# EAGLE design Nav (EAGLE 9.6.2)
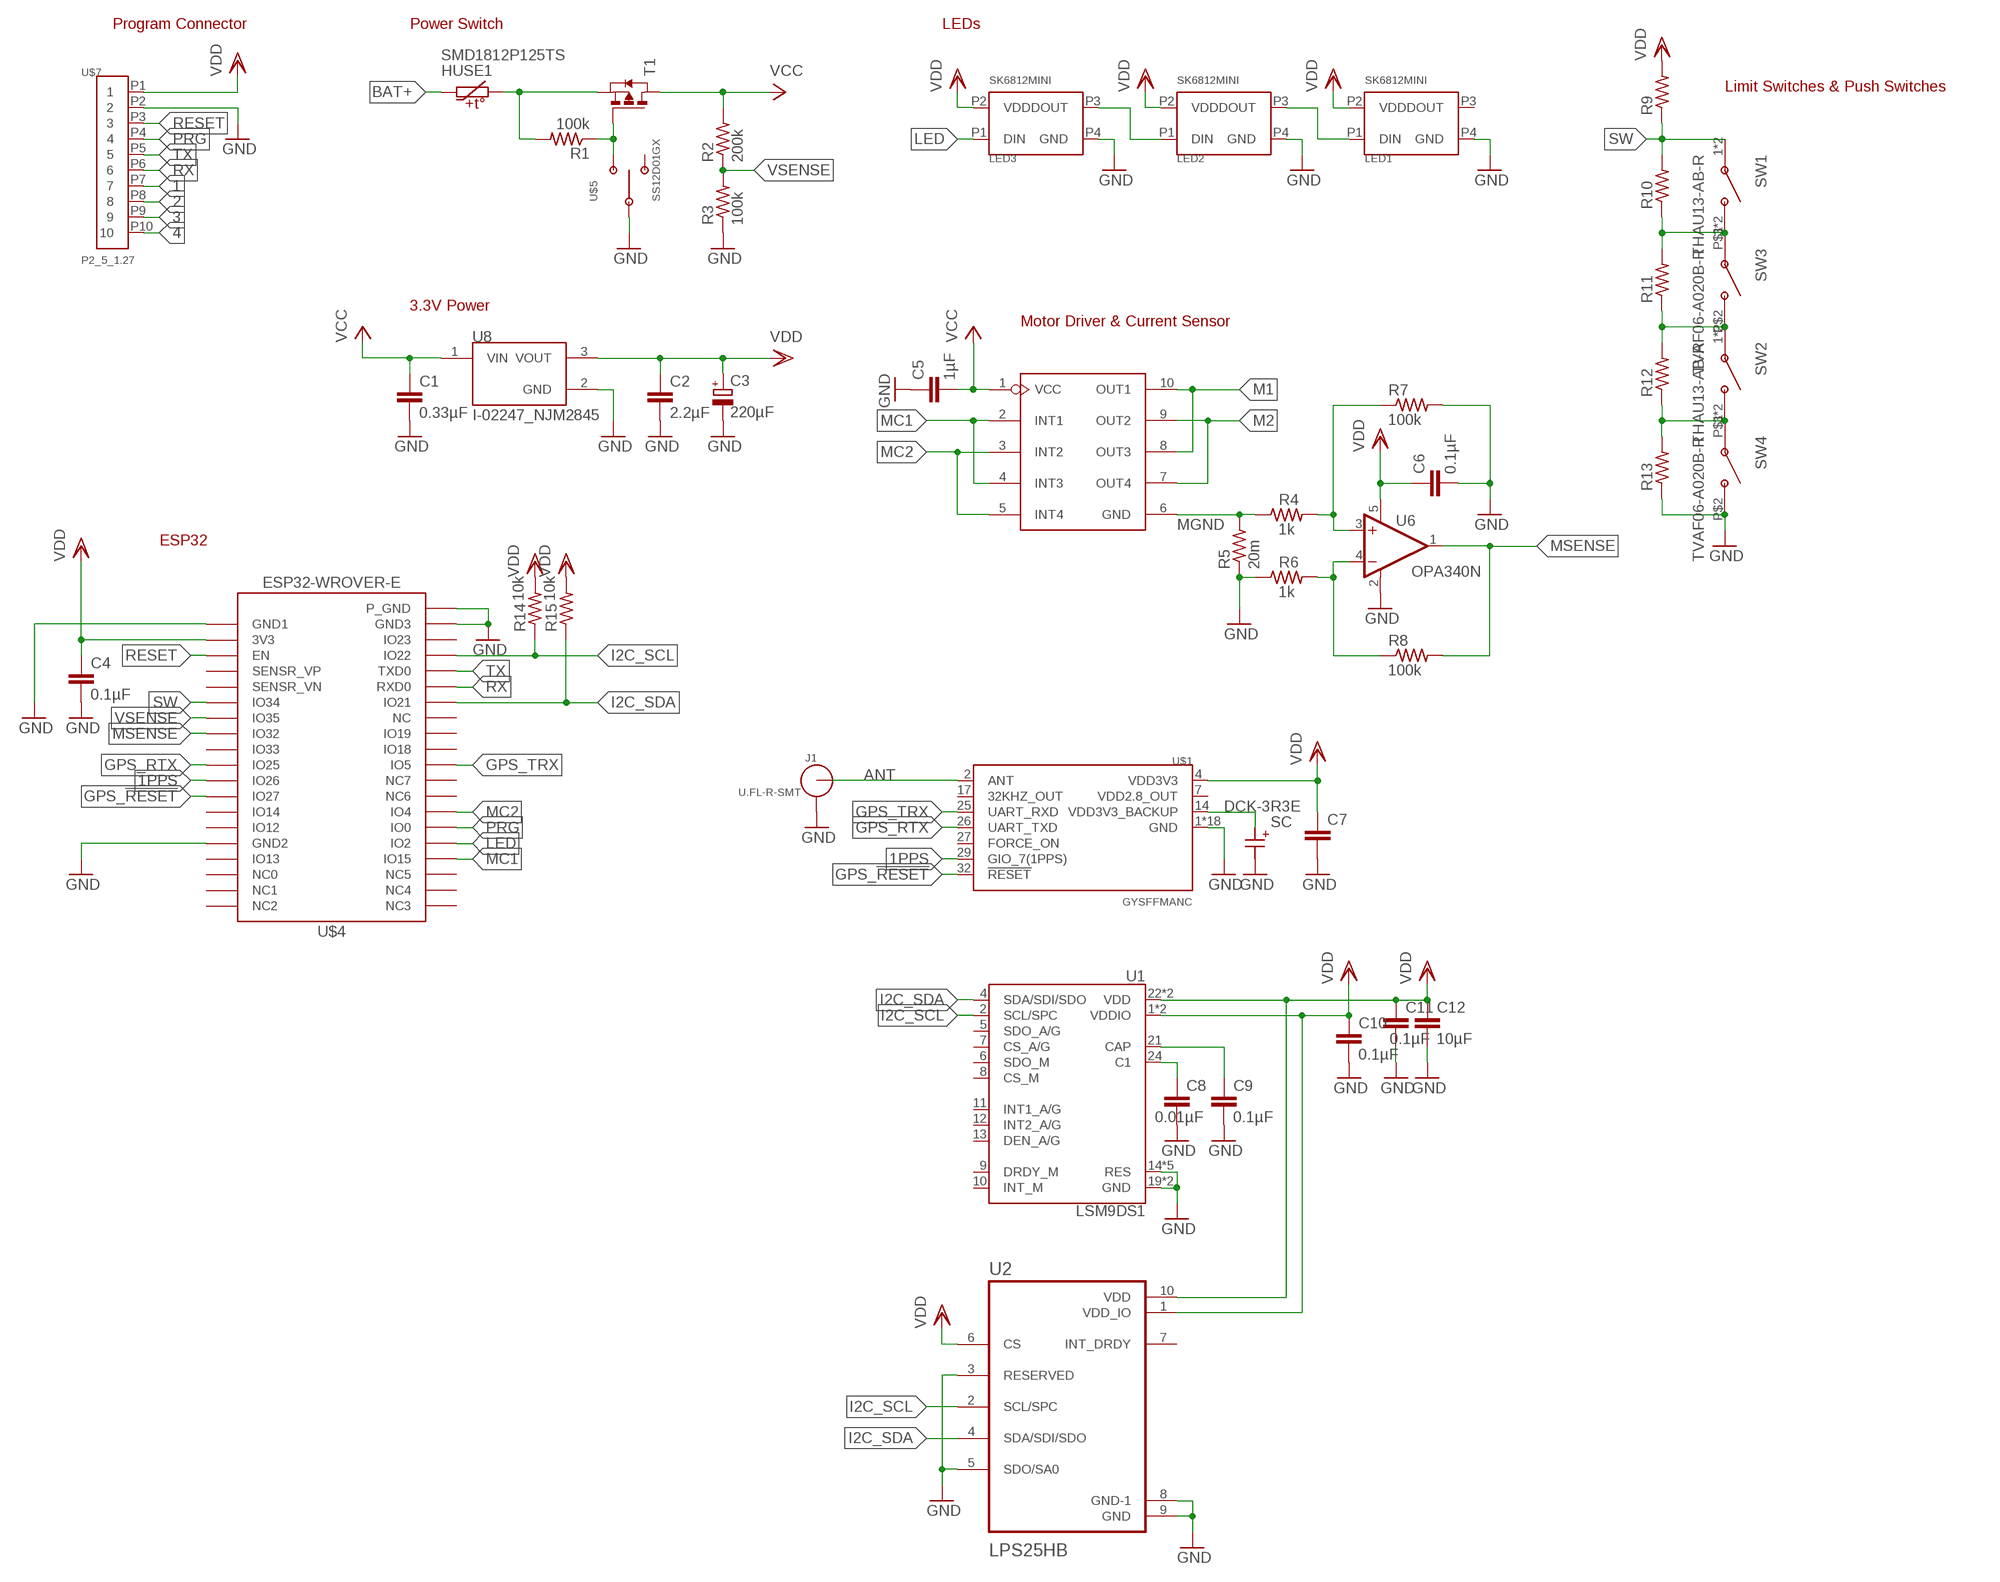
[diagram p0: schematic, sheet 1]

## Parts
C1  0.33µF  C-EUC0603  [C0603]
C2  2.2µF  C-EUC0603  [C0603]
C3  220µF  CPOL-EUUD-6,3X7,7  [UD-6,3X7,7_NICHICON]
C4  0.1µF  C-EUC0603  [C0603]
C5  1µF  C-EUC0603  [C0603]
C6  0.1µF  C-EUC0603  [C0603]
C7  C-EUC0603  [C0603]
C8  0.01µF  C-EUC0603  [C0603]
C9  0.1µF  C-EUC0603  [C0603]
C10  0.1µF  C-EUC0603  [C0603]
C11  0.1µF  C-EUC0603  [C0603]
C12  10µF  C-EUC0603  [C0603]
HUSE1  SMD1812P125TS  [SMD1812P]
J1  U.FL-R-SMT  [U.FL_SMT]
LED1  SK6812MINI  [SK68XXMINI]
LED2  SK6812MINI  [SK68XXMINI]
LED3  SK6812MINI  [SK68XXMINI]
R1  100k  R-US_R0603  [R0603]
R2  200k  R-US_R0603  [R0603]
R3  100k  R-US_R0603  [R0603]
R4  1k  R-US_R0603  [R0603]
R5  20m  R-US_R6332W  [R6332W]
R6  1k  R-US_R0603  [R0603]
R7  100k  R-US_R0603  [R0603]
R8  100k  R-US_R0603  [R0603]
R9  R-US_R0603  [R0603]
R10  R-US_R0603  [R0603]
R11  R-US_R0603  [R0603]
R12  R-US_R0603  [R0603]
R13  R-US_R0603  [R0603]
R14  10k  R-US_R0603  [R0603]
R15  10k  R-US_R0603  [R0603]
SC  DCK-3R3E  [DC,DCK]
SW1  THAU13-AB-R  [THAU13-AB-R]
SW2  THAU13-AB-R  [THAU13-AB-R]
SW3  TVAF06-A020B-R  [TVAF06-A020B-R]
SW4  TVAF06-A020B-R  [TVAF06-A020B-R]
T1  PMOSSOT23  [SOT-23]
U1  LSM9DS1  [LGA24-8X4]
U2  LPS25HB  [PQFN60P250X250X80-10N]
U6  OPA340N  [SOT23-5]
U7  DRIVER-LV8548MC-AH(SOIC10)  [SOIC10-1.0-5X4MM]
U8  I-02247_NJM2845  [TO252]
U$1  GYSFFMANC  [GYSFFMANC]
U$4  ESP32-WROVER-E  [ESP32-WROVER-E]
U$5  SS12D01GX  [SS12D01GX]
U$7  P2_5_1.27  [P2_5_1.27]

## Nets
1: U$7.P7
1PPS: U$1.29(GIO_7(1PPS)) U$4.IO26
2: U$7.P8
3: U$7.P9
4: U$7.P10
ANT: J1.SIG(ANT) U$1.2(ANT)
BAT+: HUSE1.1
GND: C1.2 C2.2 C3.- C4.2 C5.1 C6.2 C7.2 C8.2 C9.2 C10.2 C11.2 C12.2 J1.GND1 J1.GND2 LED1.P4(GND) LED2.P4(GND) LED3.P4(GND) R3.1 R5.1 R6.1 R7.2 R13.1 SC.- SW4.P$2(B) U1.14(RES) U1.15(RES) U1.16(RES) U1.17(RES) U1.18(RES) U1.19(GND) U1.20(GND) U2.3(RESERVED) U2.5(SDO/SA0) U2.8(GND-1) U2.9(GND) U6.2(V-) U8.2(GND) U$1.1(GND) U$1.3(GND) U$1.8(GND) U$1.10(GND) U$1.12(GND) U$1.22(GND) U$1.33(GND) U$1.36(GND) U$1.37(GND) U$1.38(GND) U$1.39(GND) U$1.40(GND) U$1.41(GND) U$1.42(GND) U$1.43(GND) U$1.44(GND) U$1.45(GND) U$1.46(GND) U$4.GND1 U$4.GND2 U$4.GND3 U$4.P_GND U$5.2(C) U$7.P2
GPS_!RESET!: U$1.32(!RESET!) U$4.IO27
GPS_RTX: U$1.26(UART_TXD) U$4.IO25
GPS_TRX: U$1.25(UART_RXD) U$4.IO5
I2C_SCL: R14.1 U1.2(SCL/SPC) U2.2(SCL/SPC) U$4.IO22
I2C_SDA: R15.1 U1.4(SDA/SDI/SDO) U2.4(SDA/SDI/SDO) U$4.IO21
LED: LED3.P1(DIN) U$4.IO2
M1: U7.8(OUT3) U7.10(OUT1)
M2: U7.7(OUT4) U7.9(OUT2)
MC1: U7.2(INT1) U7.4(INT3) U$4.IO15
MC2: U7.3(INT2) U7.5(INT4) U$4.IO4
MGND: R4.1 R5.2 U7.6(GND)
MSENSE: R8.2 U6.1(OUT) U$4.IO32
N$1: SC.+ U$1.14(VDD3V3_BACKUP)
N$4: C8.1 U1.24(C1)
N$6: C9.1 U1.21(CAP)
N$13: HUSE1.2 R1.2 T1.2(S)
N$14: R6.2 R8.1 U6.4(-IN)
N$15: R4.2 R7.1 U6.3(+IN)
N$16: R1.1 T1.3(G) U$5.1(A)
N$17: LED2.P1(DIN) LED3.P3(DOUT)
N$18: LED1.P1(DIN) LED2.P3(DOUT)
N$19: R11.1 R12.2 SW2.1(A) SW2.2(A) SW3.P$2(B)
N$20: R10.1 R11.2 SW1.3(B) SW1.4(B) SW3.P$1(A)
N$21: R12.1 R13.2 SW2.3(B) SW2.4(B) SW4.P$1(A)
PRG: U$4.IO0 U$7.P4
RESET: U$4.EN U$7.P3
RX: U$4.RXD0 U$7.P6
SW: R9.1 R10.2 SW1.1(A) SW1.2(A) U$4.IO34
TX: U$4.TXD0 U$7.P5
VCC: C1.1 C5.2 R2.2 T1.1(D) U7.1(VCC) U8.1(VIN)
VDD: C2.1 C3.+ C4.1 C6.1 C7.1 C10.1 C11.1 C12.1 LED1.P2(VDD) LED2.P2(VDD) LED3.P2(VDD) R9.2 R14.2 R15.2 U1.1(VDDIO) U1.3(VDDIO) U1.22(VDD) U1.23(VDD) U2.1(VDD_IO) U2.6(CS) U2.10(VDD) U6.5(V+) U8.3(VOUT) U$1.4(VDD3V3) U$4.3V3 U$7.P1
VSENSE: R2.1 R3.2 U$4.IO35
Unconnected: LED1.P3(DOUT) U1.5(SDO_A/G) U1.6(SDO_M) U1.7(CS_A/G) U1.8(CS_M) U1.9(DRDY_M) U1.10(INT_M) U1.11(INT1_A/G) U1.12(INT2_A/G) U1.13(DEN_A/G) U2.7(INT_DRDY) U$1.17(32KHZ_OUT) U$1.27(FORCE_ON) U$4.IO12 U$4.IO13 U$4.IO14 U$4.IO16(NC6) U$4.IO17(NC7) U$4.IO18 U$4.IO19 U$4.IO23 U$4.IO33 U$4.NC U$4.NC0 U$4.NC1 U$4.NC2 U$4.NC3 U$4.NC4 U$4.NC5 U$4.SENSOR_VN(SENSR_VN) U$4.SENSOR_VP(SENSR_VP) U$5.3(B)

## Notes on the sheet
- Program Connector | Power Switch | LEDs
- Limit Switches & Push Switches
- 3.3V Power
- Motor Driver & Current Sensor
- ESP32

## Power pins joined to a net without a drawn wire
VDD2.8_OUT: U$1.7(VDD2.8_OUT)

## Library data of the parts
C1 C2 C4-C12 = rcl:C-EU: CAPACITOR, European symbol; SPICEPREFIX: C
C3 = rcl:CPOL-EU: POLARIZED CAPACITOR, European symbol; SPICEPREFIX: C
HUSE1 = ptc:SMD1812P125TS
J1 = connector:U.FL-R-SMT: U.FL-R-SMT Antenna Connector; DIGIKEY: H122041-ND; MANUFACTURER: Hirose; MPN: U.FL-R-SMT-1(01)
LED1-LED3 = leds:SK6812MINI
R1-R15 = rcl:R-US_: RESISTOR, American symbol; SPICEPREFIX: R
SC = capacitors:DCK-3R3E
SW1 SW2 = switches:THAU13-AB-R
SW3 SW4 = switches:TVAF06-A020B-R
T1 = zetex:PMOSSOT23: MOS FET; OC_FARNELL: unknown; OC_NEWARK: unknown
U1 = LSM9DS1:LSM9DS1: LSM9DS1 3D accelerometer, gyroscope & magnetometer The LSM9DS1 is a system-in-package featuring a 3D digital linear acceleration sensor, a 3D digital angular rate sensor, and a 3D digital magnetic sensor. The LSM9DS1 has a linear acceleration full scale of ±2g/±4g/±8/±16 g, a magnetic field full scale of ±4/±8/±12/±16 gauss and an angular rate of ±245/±500/±2000 dps. The LSM9DS1 includes an I2 C serial bus interface supporting standard and fast mode (100 kHz and 400 kHz) and an SPI serial standard interface. Magnetic, accelerometer and gyroscope sensing can be enabled or set in power-down mode separately for smart power management. The LSM9DS1 is available in a plastic land grid array package (LGA) and it is guaranteed to operate over an extended temperature range from -40 °C to +85 °C.; PROD_ID: IC-12536
U2 = LPS25HB:LPS25HB: None Check availability <https://pricing.snapeda.com/parts/LPS25HB/STMicroelectronics/view-part?ref=eda>; AVAILABILITY: In Stock; DESCRIPTION: Pressure Sensor 3.77PSI ~ 18.27PSI (26kPa ~ 126kPa) Absolute - 24 b 10-VFLGA; MF: STMicroelectronics; MP: LPS25HB; PACKAGE: VFLGA-10 STMicroelectronics; PRICE: None; PURCHASE-URL: https://pricing.snapeda.com/search/part/LPS25HB/?ref=eda
U6 = burr-brown:OPA340: Rail-to-Rail Operational Amplifiers Single-Supply, MicroAmplifier(TM) Series; MPN: OPA340NA/3KG4; OC_FARNELL: 1234805; OC_NEWARK: 13M5177
U7 = DRIVER-LV8548MC-AH_SOIC10_:DRIVER-LV8548MC-AH(SOIC10): 310030259 Check prices <https://pricing.snapeda.com/parts/LV8548MC-AH/ON%20Semiconductor/view-part?ref=eda>; AVAILABILITY: Not in stock; DESCRIPTION: Half Bridge (4) Driver DC Motors, General Purpose, Stepper Motors DMOS 10-SOIC; MF: ON Semiconductor; MP: LV8548MC-AH; PACKAGE: SOIC NB-10 ON Semiconductor; PRICE: None
U8 = akizuki:I-02247_NJM2845
U$1 = gps:GYSFFMANC
U$4 = esp32:ESP32-WROVER-E
U$5 = switches:SS12D01GX
U$7 = pins:P2_5_1.27

## Board
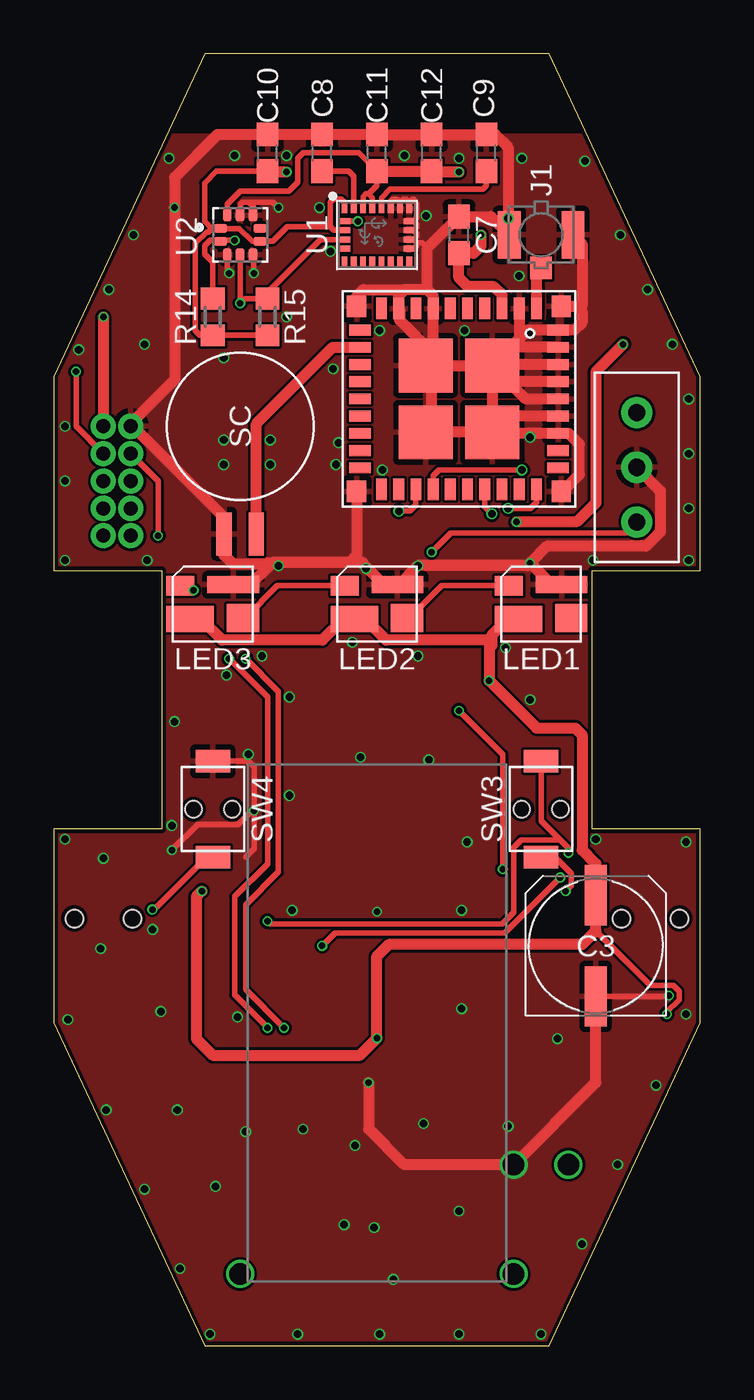
[diagram p1: board, top side]
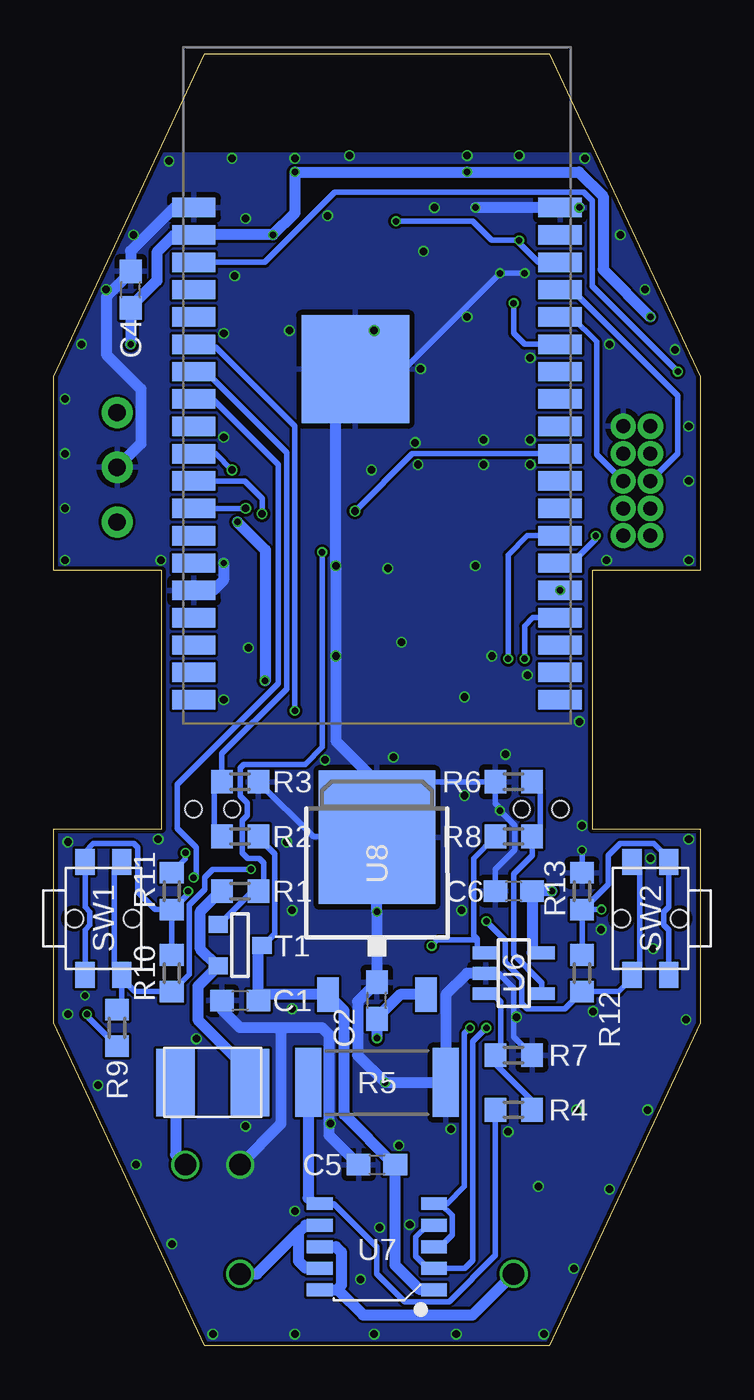
[diagram p2: board, bottom side, seen from below]

Size 30 x 60 mm. Coordinates in mm from the lower left corner, seen from the top.
Outline: 7,0 23,0 30,15 30,24 25,24 25,36 30,36 30,45 23,60 7,60 0,45 0,36 5,36 5,24 0,24 0,15 7,0
Copper layers (1*16): Top 0.035mm / dielectric 1mm / Bottom 0.035mm
Design rules "jlcpcb-2layers-1.0mm": minimum track width 5mil, minimum drill 0.3mm, track to track 5mil, track to pad 5mil, pad to pad 5mil, via to via 5mil, smd to smd 5mil, copper to edge 0.2mm, drill to drill 6mil, minimum pad ring 10mil, minimum via ring 3mil, stop-mask expansion 4mil, vias tented up to drill 0mil, thermal gap 10mil
tKeepout: area -35,27.5 to 65,32.5

### Footprints (pad centres in the part's own frame; a part is rotated, then mirrored left to right if it is on the bottom)
C0603 = smd 1.1 x 1: 1 -0.85,0; 2 0.85,0
UD-6,3X7,7_NICHICON = smd 2.8 x 1: + 2.35,0; - -2.35,0
SMD1812P = smd 1.78 x 3.15: 1 -1.725,0; 2 1.725,0
U.FL_SMT = smd 1.05 x 2.2: GND1 -1.475,0; GND2 1.475,0 | smd 1 x 1.05: SIG 0,-1.525
SK68XXMINI = smd 1.3 x 0.9: P1 1.5,-0.85 | smd 2.2 x 1.2: P2 1.05,0.7 | smd 1.5 x 1.3: P3 -1.4,0.65 | smd 2.4 x 0.8: P4 -0.95,-0.9
R0603 = smd 1 x 1.1: 1 -0.85,0; 2 0.85,0
R6332W = smd 1.2 x 3.2: 1 -3.196,0; 2 3.196,0
DC,DCK = smd 0.7 x 2: + 0.75,-5; - -0.75,-5
THAU13-AB-R = smd 1.2 x 0.9: 1 -2.625,0.85; 2 2.625,0.85; 3 -2.625,-0.85; 4 2.625,-0.85 | hole 0.8: 0,1.35; 0,-1.35
TVAF06-A020B-R = smd 1.6 x 1.05: P$1 0,2.225; P$2 0,-2.225 | hole 0.75: -0.9,0; 0.9,0
SOT-23 = smd 0.787 x 0.889: 1 0.025,-1.016; 2 -0.94,1.016; 3 0.991,1.016
LGA24-8X4 = smd 0.27 x 0.45: 1 -1.505,1.225; 6 -1.505,-1.225; 7 -1.075,-1.225; 8 -0.645,-1.225; 9 -0.215,-1.225; 10 0.215,-1.225; 11 0.645,-1.225; 12 1.075,-1.225; 13 1.505,-1.225; 18 1.505,1.225; 19 1.075,1.225; 20 0.645,1.225; 21 0.215,1.225; 22 -0.215,1.225; 23 -0.645,1.225; 24 -1.075,1.225 | smd 0.45 x 0.27: 2 -1.475,0.645; 3 -1.475,0.215; 4 -1.475,-0.215; 5 -1.475,-0.645; 14 1.475,-0.645; 15 1.475,-0.215; 16 1.475,0.215; 17 1.475,0.645
PQFN60P250X250X80-10N = smd 0.59 x 0.4: 1 -0.92,0.3; 2 -0.92,-0.3; 6 0.92,-0.3; 7 0.92,0.3 | smd 0.4 x 0.59: 3 -0.6,-0.92; 4 0,-0.92; 5 0.6,-0.92; 8 0.6,0.92; 9 0,0.92; 10 -0.6,0.92
SOT23-5 = smd 0.6 x 1.2: 1 -0.95,-1.306; 2 0,-1.306; 3 0.95,-1.306; 4 0.95,1.306; 5 -0.95,1.306
SOIC10-1.0-5X4MM = smd 0.6 x 1.2: 1 -2,-2.65; 2 -1,-2.65; 3 0,-2.65; 4 1,-2.65; 5 2,-2.65; 6 2,2.65; 7 1,2.65; 8 0,2.65; 9 -1,2.65; 10 -2,2.65
TO252 = smd 1 x 1.6: 1 -2.28,-4.8; 3 2.28,-4.8 | smd 5.4 x 6.2: 2 0,2.5
GYSFFMANC = smd 1 x 0.9: 1 -4.3,4.75; 12 -4.3,-4.75; 22 4.3,-4.75; 33 4.3,4.75 | smd 1 x 0.5: 2 -4.2,3.6; 3 -4.2,2.8; 4 -4.2,2; 5 -4.2,1.2; 6 -4.2,0.4; 7 -4.2,-0.4; 8 -4.2,-1.2; 9 -4.2,-2; 10 -4.2,-2.8; 11 -4.2,-3.6; 23 4.2,-3.6; 24 4.2,-2.8; 25 4.2,-2; 26 4.2,-1.2; 27 4.2,-0.4; 28 4.2,0.4; 29 4.2,1.2; 30 4.2,2; 31 4.2,2.8; 32 4.2,3.6 | smd 0.5 x 1: 13 -3.2,-4.6; 14 -2.4,-4.6; 15 -1.6,-4.6; 16 -0.8,-4.6; 17 0,-4.6; 18 0.8,-4.6; 19 1.6,-4.6; 20 2.4,-4.6; 21 3.2,-4.6; 34 3.2,4.6; 35 2.4,4.6; 36 1.6,4.6; 37 0.8,4.6; 38 0,4.6; 39 -0.8,4.6; 40 -1.6,4.6; 41 -2.4,4.6; 42 -3.2,4.6 | smd 2.5 x 2.5: 43 -1.55,1.55; 44 -1.55,-1.55; 45 1.55,-1.55; 46 1.55,1.55
ESP32-WROVER-E = smd 2 x 0.9: 3V3 -8.5,10.16; EN -8.5,8.89; GND1 -8.5,11.43; GND2 -8.5,-6.35; GND3 8.5,11.43; IO0 8.5,-5.08; IO2 8.5,-6.35; IO4 8.5,-3.81; IO5 8.5,0; IO12 -8.5,-5.08; IO13 -8.5,-7.62; IO14 -8.5,-3.81; IO15 8.5,-7.62; IO16 8.5,-2.54; IO17 8.5,-1.27; IO18 8.5,1.27; IO19 8.5,2.54; IO21 8.5,5.08; IO22 8.5,8.89; IO23 8.5,10.16; IO25 -8.5,0; IO26 -8.5,-1.27; IO27 -8.5,-2.54; IO32 -8.5,2.54; IO33 -8.5,1.27; IO34 -8.5,5.08; IO35 -8.5,3.81; NC 8.5,3.81; NC0 -8.5,-8.89; NC1 -8.5,-10.16; NC2 -8.5,-11.43; NC3 8.5,-11.43; NC4 8.5,-10.16; NC5 8.5,-8.89; RXD0 8.5,6.35; SENSOR_VN -8.5,6.35; SENSOR_VP -8.5,7.62; TXD0 8.5,7.62 | smd 5 x 5: P_GND -1,3.93
SS12D01GX = drill 0.8: 1 -2.54,0; 2 0,0; 3 2.54,0
P2_5_1.27 = drill 0.65 pad 1.016: P1 0,2.54; P2 1.27,2.54; P3 0,1.27; P4 1.27,1.27; P5 0,0; P6 1.27,0; P7 0,-1.27; P8 1.27,-1.27; P9 0,-2.54; P10 1.27,-2.54

### Placement (x,y rotation side)
C1  21.35,16.03 180 bottom
C2  15,16.03 90 bottom
C3  25.16,18.57 90 top
C4  26.43,49.05 90 bottom
C5  15,8.41 0 bottom
C6  8.65,21.11 180 bottom
C7  18.81,51.59 90 top
C8  12.46,55.4 90 top
C9  20.08,55.4 90 top
C10  9.92,55.4 90 top
C11  15,55.4 90 top
C12  17.54,55.4 90 top
HUSE1  22.62,12.22 0 bottom
J1  22.62,51.59 0 top
LED1  22.62,34.45 180 top
LED2  15,34.45 180 top
LED3  7.38,34.45 180 top
R1  21.35,21.11 180 bottom
R2  21.35,23.65 0 bottom
R3  21.35,26.19 180 bottom
R4  8.65,10.95 0 bottom
R5  15,12.22 180 bottom
R6  8.65,26.19 0 bottom
R7  8.65,13.49 0 bottom
R8  8.65,23.65 180 bottom
R9  27.06,14.76 270 bottom
R10  24.52,17.3 270 bottom
R11  24.52,21.11 270 bottom
R12  5.47,17.3 270 bottom
R13  5.47,21.11 270 bottom
R14  7.38,47.78 270 top
R15  9.92,47.78 270 top
SC  8.65,42.7 0 top
SW1  27.7,19.84 270 bottom
SW2  2.3,19.84 90 bottom
SW3  22.62,24.92 180 top
SW4  7.38,24.92 180 top
T1  21.35,18.57 90 bottom
U1  15,51.59 0 top
U2  8.65,51.59 0 top
U6  8.65,17.3 270 bottom
U7  15,4.6 90 bottom
U8  15,21.11 0 bottom
U$1  18.81,43.97 270 top
U$4  15,41.43 0 bottom
U$5  27.06,40.8 90 top
U$7  2.3,40.16 0 top

### Tracks (layer width: path | path; a pad name or v marks a point on that pad's centre or on a via)
1PPS  (via drill 0.35)
  Top 0.254: v20.33,38.64 20.01,38.96 U$1.29
  Bottom 0.254: U$4.IO26 21.14,40.16 20.33,39.35 v20.33,38.64
ANT
  Top 0.508: U$1.2 22.41,49.86 J1.SIG
BAT+  (via drill 1 pad 1.3)
  Bottom 0.508: v23.89,8.41 24.34,8.86 HUSE1.1
GND  (via drill 0.3, 0.35, 1 pad 1.3)
  Top 0.254: U2.9 8.65,52.99 8.78,53.11 9.03,53.11 | 9.03,53.11 9.25,52.89 U2.8 | U1.20 15.64,53.12 15.76,53.24 15.92,53.24 16.07,53.09 | 16.07,53.09 U1.19 | 16.5,53.09 16.35,53.24 16.23,53.24 16.07,53.09 | U1.18 | U1.18 16.5,53.09 | 16.85,51.22 16.85,51.1 16.69,50.94 16.48,50.94 U1.14 | 16.85,51.22 16.7,51.38 U1.15 | U1.15 | 16.76,51.74 16.85,51.65 16.85,51.53 16.7,51.38 U1.15 | U1.17 16.7,52.23 | U1.17 | 16.7,52.23 | 16.5,53.09 16.66,53.24 | 16.7,53.24 16.66,53.24 | 16.66,53.24 16.86,53.04 16.86,52.39 16.76,52.3 16.7,52.23 | 16.85,51.22 17.08,51.22 17.34,50.97 | 9.03,53.11 10.17,53.11 v10.43,52.86 | U2.5 9.29,50.64 v9.29,49.81 | U2.3 8.05,49.9 v8.14,49.81 | U1.16 16.7,51.8 16.85,51.96 16.85,52.08 16.7,52.23 | C3.- 28.51,16.22 v28.55,16.26 | 8.9,22.7 9.29,23.09 v9.29,24.85 | SW4.P$2 9.03,27.14 9.29,26.88 v9.29,24.85 | v5.47,23.02 6.68,24.22 8.57,24.22 9.21,24.85 v9.29,24.85 | U1.17 16.7,52.23
  Top 0.508: 13.73,36.38 10.16,36.38 10.1,36.32 | 10.1,36.32 8.3,36.32 7.9,36.72 SC.- 7.9,38.47 3.67,42.7 U$7.P2 3.57,42.83 5.6,44.86 v5.6,52.86 5.6,54.26 7.59,56.25 C10.2 C8.2 C11.2 C12.2 C9.2 20.5,56.25 21.1,55.65 v21.1,52.35 21.1,51.64 J1.GND1 20.3,52.44 C7.2 17.34,50.97 17.34,49.05 | U$1.44 17.61,45.87 U$1.8 17.61,48.78 17.34,49.05 | 17.34,49.05 16.28,49.05 | 16.28,49.05 16.01,48.78 U$1.10 16.05,48.13 16.05,47.64 17.26,46.43 U$1.44 | 20.41,42.37 U$1.36 23.9,42.37 24.4,41.87 24.4,40.47 23.6,39.67 U$1.33 | U$1.3 21.61,46.77 | 21.61,46.77 21.35,46.51 | 21.35,46.51 20.41,45.57 | 21.61,46.77 22.01,47.17 U$1.42 24.17,47.17 24.52,47.53 24.52,48.03 24.29,48.27 | U$1.41 21.49,46.37 21.35,46.51 | U$1.40 20.41,45.57 | U$1.39 21.11,44.77 U$1.43 | U$1.38 21.91,43.97 U$1.43 | U$1.37 21.21,43.17 20.41,42.37 | 24.29,48.27 24.52,48.27 24.52,51.16 J1.GND2 | U$1.1 24.29,48.27 | U$1.22 14.06,36.71 13.73,36.38 | U$1.12 14.06,48.75 14.37,49.05 16.28,49.05 | U$1.44 17.54,45.52 | 17.54,45.52 U$1.43 | U$1.43 20.41,45.57 | U$1.43 U$1.46 | U$1.46 20.41,42.37 | U$1.46 U$1.45 17.54,42.7 17.54,45.52 | LED2.P4 15.15,35.34 | 10.1,36.32 10.03,36.24 | 10.03,36.24 9.13,35.34 LED3.P4 | LED2.P4 16.03,35.34 v16.91,36.22 21.98,36.22 v22.11,36.35 | LED1.P4 23.12,35.34 v22.11,36.35 | C3.- 25.16,12.22 v21.35,8.41 16.27,8.41 14.62,10.06 v14.62,12.22 | U$5.2 28.17,39.69 28.17,37.8 27.49,37.13 22.89,37.13 v22.11,36.35 | 9.92,36.35 10.03,36.24 | LED2.P4 15.31,35.34 14.37,36.3 14.37,36.35 14.34,36.38 13.73,36.38
  Bottom 0.254: v8.14,49.81 v9.29,49.81 13.74,45.36 U$4.P_GND | U6.2 9.35,17.3 8.65,16.6 8.65,14.34 R7.2 | R6.1 12.42,26.19 14.96,23.65 | 14.96,23.65 U8.2 | R3.1 17.96,23.65 14.96,23.65 | R6.1 9.5,26.24 | 9.45,21.11 C6.2 9.5,22.13 8.61,23.02 8.61,24.17 v9.29,24.85 9.29,24.98 9.5,25.19 R6.1 | v5.47,23.02 R13.1
  Bottom 0.508: U$4.GND1 24.41,52.86 26.43,50.84 C4.2 26.43,49.85 27.56,48.72 27.56,46.03 25.96,44.43 25.96,41.9 U$5.2 | C5.1 17.21,9.77 17.21,14.44 17.54,14.76 19.45,14.76 | 19.45,14.76 21.35,14.76 22.2,15.61 C1.2 | U6.2 10.81,17.3 11.8,16.3 R5.1 v14.62,12.22 15.89,13.49 15.89,15.99 C2.2 v15,20.16 U8.2 15,26.19 16.91,28.09 v16.91,32.03 v16.91,36.22 16.91,45.36 U$4.P_GND | v22.11,36.35 22.11,35.56 22.59,35.08 U$4.GND2 | U$4.P_GND 15.88,45.24 | 15,44.36 U$4.P_GND | v21.35,8.41 19.45,10.32 19.45,14.76 | v5.6,52.86 U$4.GND3 v10.43,52.86
  other vias: 29.48,36.48 29.48,38.89 29.48,41.43 29.48,43.97 28.72,46.51 27.57,49.05 26.3,51.59 24.65,55.02 21.73,55.15 18.81,55.15 16.27,55.27 10.81,55.27 8.4,55.27 5.35,55.15 3.7,51.59 2.55,49.05 1.16,46.26 0.52,42.7 0.52,40.16 0.52,36.48 4.33,36.48 5.6,28.98 5.47,24.16 0.52,23.52 0.65,15.14 2.43,10.95 4.21,7.27 5.86,3.58 7.25,0.54 11.32,0.54 15.13,0.54 18.81,0.54 22.62,0.54 24.52,4.73 26.18,8.41 27.95,12.09 29.35,15.39 29.35,23.4 25.16,23.52 22.11,30 20.97,32.41 25.03,36.48 10.43,36.22 14.49,36.1 13.1,40.92 10.05,40.92 10.05,42.06 13.22,41.94 12.97,45.37 17.29,52.48 12.84,50.83 10.81,47.78 7.89,45.88 7.89,42.06 7.89,40.92 4.21,46.51 22.11,47.02 22.11,42.19 19.06,47.14 15.25,40.67 15.13,47.14 13.86,32.67 9.67,32.03 10.94,30.13 10.94,25.55 11.06,20.22 8.02,31.14 9.03,27.46 8.52,15.27 8.9,9.93 4.59,19.33 2.3,22.63 2.17,18.44 4.97,15.52 5.73,10.95 7.51,7.39 17.16,10.32 14.87,5.49 21.1,10.19 23.38,14.25 18.94,15.65 15.76,3.08 18.81,6.25 13.98,9.3 11.57,10.06 13.48,5.62 18.94,20.22 19.19,23.4 17.41,27.21 14.24,27.33 12.33,52.86 21.6,49.69
  pour Top: -2.78,56.29 32.78,56.29 32.78,-1.75 -2.78,-1.75
  pour Bottom: -4.05,55.4 34.05,55.4 34.05,-1.75 -1.51,-1.75 -4.05,-1.75
GPS_!RESET!  (via drill 0.35)
  Top 0.254: U$1.32 22.41,39.19 22.11,38.89 v21.1,38.89 20.97,38.89
  Bottom 0.254: v21.1,38.89 U$4.IO27
GPS_RTX  (via drill 0.35)
  Top 0.254: U$1.26 17.61,40.41 17.87,40.67 v21.73,40.67
  Bottom 0.254: U$4.IO25 22.49,41.43 v21.73,40.67
GPS_TRX  (via drill 0.35)
  Top 0.254: U$1.25 16.81,39.05 16.52,38.76 v16.02,38.76
  Bottom 0.254: v16.02,38.76 13.35,41.43 U$4.IO5
I2C_SCL  (via drill 0.3)
  Top 0.254: U1.2 v14.1,52.23 v14.11,52.23 | U2.2 7.78,51.34 | 7.78,51.34 v8.4,51.34 | R14.1 7.38,50.32 7,50.7 7,51.08 7.25,51.34 7.78,51.34
  Bottom 0.254: v14.11,52.23 10.55,52.23 9.67,51.34 v8.4,51.34 8.4,51.21 7.51,50.32 U$4.IO22
I2C_SDA  (via drill 0.3)
  Top 0.254: U2.4 8.65,50.32 8.65,50.07 v8.65,48.41 8.87,48.63 R15.1 9.92,48.92 12.37,51.38 U1.4
  Bottom 0.254: v8.65,48.41 8.65,47.02 8.14,46.51 U$4.IO21
LED  (via drill 0.3)
  Top 0.254: v6.49,35.08 6.28,35.3 LED3.P1
  Bottom 0.254: U$4.IO2 v6.49,35.08
M1  (via drill 1 pad 1.3)
  Bottom 0.508: U7.8 16.91,4.6 16.65,4.35 16.65,2.82 16.87,2.6 | U7.10 16.87,2.6 | 16.87,2.6 16.81,2.6 15.63,1.43 10.55,1.43 v8.65,3.33
M2  (via drill 1 pad 1.3)
  Bottom 0.508: U7.9 18.31,3.6 18.63,3.92 18.63,5.28 | 18.63,5.28 18.31,5.6 U7.7 | v21.35,3.33 20.58,3.33 18.63,5.28
MC1  (via drill 0.3)
  Top 0.254: v9.92,14.76 8.4,16.28 8.4,20.86 9.92,22.38 9.92,30.13 v8.14,31.91
  Bottom 0.254: U7.4 12.65,5.6 13.2,5.05 13.2,4.15 12.65,3.6 U7.2 10.92,3.6 10.55,3.96 10.55,14.12 v9.92,14.76 | U$4.IO15 7.76,33.81 8.14,33.43 v8.14,31.91
MC2  (via drill 0.3)
  Top 0.254: v8.9,31.91 10.43,30.38 10.43,22 8.9,20.48 8.9,16.54 v10.68,14.76
  Bottom 0.254: U7.3 12.05,4.6 11.5,5.15 11.5,6.05 12.05,6.6 U7.5 11.73,6.6 10.94,7.39 10.94,14.51 v10.68,14.76 | U$4.IO4 8.02,37.62 8.9,36.73 v8.9,31.91
MGND
  Bottom 0.254: U7.6 17,6.6 15,4.6 15,3.33 13.72,2.05 11.64,2.05 9.5,4.19 R4.1
  Bottom 0.508: R5.2 18.2,6.85 17.95,6.6 U7.6
MSENSE  (via drill 0.3)
  Top 0.254: v12.46,18.57 13.06,19.17 20.93,19.17 v23.51,21.74
  Bottom 0.254: R8.2 10.52,22.63 10.52,19.06 10.34,18.88 10.34,18.84 | 10.34,18.84 10.34,18.25 U6.1 | 10.34,18.84 12.19,18.84 v12.46,18.57 | v23.51,21.74 23.38,21.87 23.38,23.14 24.27,24.03 24.27,26.06 19.57,30.76 19.57,40.92 22.62,43.97 U$4.IO32
N$1
  Top 0.508: SC.+ 9.4,42.81 12.96,46.37 U$1.14
N$4
  Top 0.254: U1.24 13.93,54.32 13.69,54.55 C8.1
N$6
  Top 0.254: C9.1 20.08,53.88 19.92,53.72 15.6,53.72 15.21,53.33 U1.21
N$13
  Bottom 0.508: HUSE1.2 20.89,12.73 23.31,15.14 23.31,16.69 T1.2 22.42,17.63 23.19,18.41 23.19,20.17 22.25,21.11 R1.2
N$14
  Bottom 0.254: R6.2 7.42,25.81 7.42,24.03 R8.1 | R8.1 7.8,23.4 | 7.64,16.35 U6.4 7.34,16.86 8.65,18.16 8.65,21.91 7.8,22.76 R8.1
N$15
  Bottom 0.254: R4.2 7.8,11.38 9.5,13.08 R7.1 9.25,13.74 9.25,15.97 9.63,16.35 U6.3
N$16  (via drill 0.3)
  Top 0.254: U$5.1 26.56,37.75 18.43,37.75 v17.54,36.86
  Bottom 0.254: T1.3 22.32,19.56 20.77,21.11 R1.1 20.25,21.36 20.25,22.42 20.46,22.63 21.01,22.63 21.25,22.88 21.25,24.39 21.02,24.63 21.02,25.21 21.35,25.54 21.35,26.82 21.17,27 18.34,27 17.54,27.8 v17.54,36.86
N$17
  Top 0.254: LED2.P1 10.38,35.3 8.88,33.8 LED3.P3
N$18
  Top 0.254: 16.45,33.74 LED2.P3 16.5,33.8 18,35.3 LED1.P1
N$19  (via drill 0.3)
  Top 0.254: v23.89,22.89 23.89,23.11 23.51,23.49 | 23.51,23.49 22.62,24.38 SW3.P$2 | v9.92,19.71 10.05,19.59 20.81,19.59 21.35,20.12 21.35,23.14 21.7,23.49 23.51,23.49
  Bottom 0.254: R11.1 23.89,22.59 v23.89,22.89 | SW2.2 2.8,22.11 2.8,17.57 SW2.1 3.15,17.06 3.77,16.45 R12.2 6.28,15.65 8.02,15.65 8.27,15.9 8.27,17.05 9.03,17.81 9.03,18.82 v9.92,19.71
N$20  (via drill 0.3)
  Top 0.254: SW3.P$1 23.26,22.7 24.02,21.93 24.02,21.36 v23.76,21.11
  Bottom 0.254: R11.2 24.48,20.26 23.76,20.97 v23.76,21.11 | SW1.4 28.55,19.31 28.32,19.54 28.32,20.14 28.55,20.37 SW1.3 28.55,22.94 28.17,23.32 26.3,23.32 26.11,23.13 26.11,21.08 25.29,20.26 R11.2 | R10.1 R11.2
N$21  (via drill 0.3)
  Top 0.254: v4.57,20.26 4.67,20.26 7.11,22.7 SW4.P$1
  Bottom 0.254: R13.2 5.43,20.26 4.26,21.42 4.26,22.76 3.71,23.32 2.15,23.32 1.45,22.62 SW2.4 1.45,20.37 1.68,20.14 1.68,19.54 1.45,19.31 SW2.3 | R12.1 R13.2 | R13.2 v4.57,20.26
PRG  (via drill 0.3)
  Top 0.254: U$7.P4 4.84,40.16 v4.84,37.62
  Bottom 0.254: U$4.IO0 5.95,36.35 4.84,37.46 v4.84,37.62
RESET  (via drill 0.3)
  Top 0.254: U$7.P3 1.03,42.7 v1.03,45.24
  Bottom 0.254: U$4.EN 20.2,50.32 16.96,53.56 5.39,53.56 5.01,53.18 5.01,49.22 v1.03,45.24
RX
  Bottom 0.254: U$4.RXD0 5.95,47.78 4.8,46.63 4.8,41.39 U$7.P6
SW  (via drill 0.3)
  Top 0.254: v20.84,22.13 20.84,27.46 v18.81,29.49
  Bottom 0.254: SW1.2 27.2,17.57 27.2,22.11 SW1.1 | SW1.2 26.85,17.06 26.23,16.45 R10.2 23.72,17.25 23.72,20.47 23,21.19 23,21.74 22.62,22.13 v20.84,22.13 | R9.1 26.85,15.82 SW1.2 | U$4.IO34 23.37,46.38 22.49,46.38 18.81,42.7 v18.81,29.49
TX
  Bottom 0.254: U$7.P5 1.03,41.43 1.03,43.97 1.03,44.13 5.95,49.05 U$4.TXD0
VCC
  Bottom 0.254: T1.1 20.28,18.59 19.75,19.13 19.75,22.85 20.5,23.6 R2.2
  Bottom 0.508: U7.1 13.01,2.6 14.15,3.74 C5.2 14.2,8.41 16.53,10.74 16.53,15.56 U8.1 20.22,16.31 C1.1 20.5,18.43 T1.1
VDD  (via drill 0.3)
  Top 0.254: C10.1 7.55,54.55 7,54 7,52.23 7.33,51.89 | 7.33,51.89 U2.1 8.6,51.89 9.2,51.29 U2.6 9.59,51.31 10.17,51.31 10.83,51.97 12.84,51.97 | U1.3 13.01,51.8 12.84,51.97 | U1.1 13.5,53.09 13.35,53.24 12.97,53.24 12.84,53.11 12.84,51.97 | U1.22 14.79,53.33 14.62,53.5 | 14.62,53.5 14.49,53.5 14.36,53.36 U1.23 | U2.10 8.05,53.02 8.65,53.62 10.9,53.62 11.32,54.04 11.32,55.15 11.57,55.4 14.15,55.4 C11.1 15,53.88 14.62,53.5 | R15.2 R14.2 6.78,46.93 6.58,47.14 6.58,51.2 7.09,51.72 7.16,51.72 7.33,51.89 | LED3.P2 5.83,33.74 5.63,33.54 | 25.16,19.27 27.69,16.74 28.75,16.74 29.03,16.46 29.03,16.06 28.46,15.49 v28.46,15.39
  Top 0.508: C11.1 C12.1 17.58,54.51 v18.81,54.51 | v10.81,54.51 9.96,54.51 C10.1 | U$1.4 20.81,48.8 20.43,49.19 19.22,49.19 18.81,49.6 C7.1 19.48,50.74 19.83,51.08 v19.83,51.59 | LED1.P2 21.07,33.74 20.33,33.01 20.33,32.54 20.21,32.67 | LED3.P2 6.83,33.74 7.81,32.76 12.47,32.76 13.45,33.74 LED2.P2 14.45,33.74 15.43,32.76 20.11,32.76 20.21,32.67 | v26.43,46.51 25.16,45.24 25.16,39.14 24.27,38.26 v21.48,38.26 | 20.21,32.67 v20.21,30.89 22.41,28.69 24.21,28.69 24.52,28.37 24.52,23.02 25.16,22.38 C3.+ 25.16,19.27 24.52,18.63 15.55,18.63 15,18.09 v15,14.28 14.21,13.49 7.38,13.49 6.62,14.25 6.62,20.86 v6.87,21.11 | v2.3,47.78 U$7.P1
  Bottom 0.254: R9.2 28.46,15.31 v28.46,15.39
  Bottom 0.508: U8.3 13.92,16.31 15,15.23 C2.1 v15,14.28 | v21.48,38.26 20.18,36.96 20.18,30.92 v20.21,30.89 | v26.43,46.51 C4.1 26.43,48.25 25.21,49.47 25.21,50.78 24.41,51.59 U$4.3V3 v19.83,51.59 18.81,52.61 v18.81,54.51 v10.81,54.51 5.62,54.51 4.5,53.39 4.5,49.98 v2.3,47.78 | v6.87,21.11 C6.1 7.8,18.25 U6.5
VSENSE
  Bottom 0.254: R2.1 22.55,24 22.55,25.84 R3.2 22.2,27.5 19.19,30.51 19.19,41.48 22.95,45.24 U$4.IO35

### Text on the board
tStop: 2022 WASA Rocket